# Altium schematic sheet BCM4.SchDoc
size A4; SheetNumber: 4; SheetTotal: 5
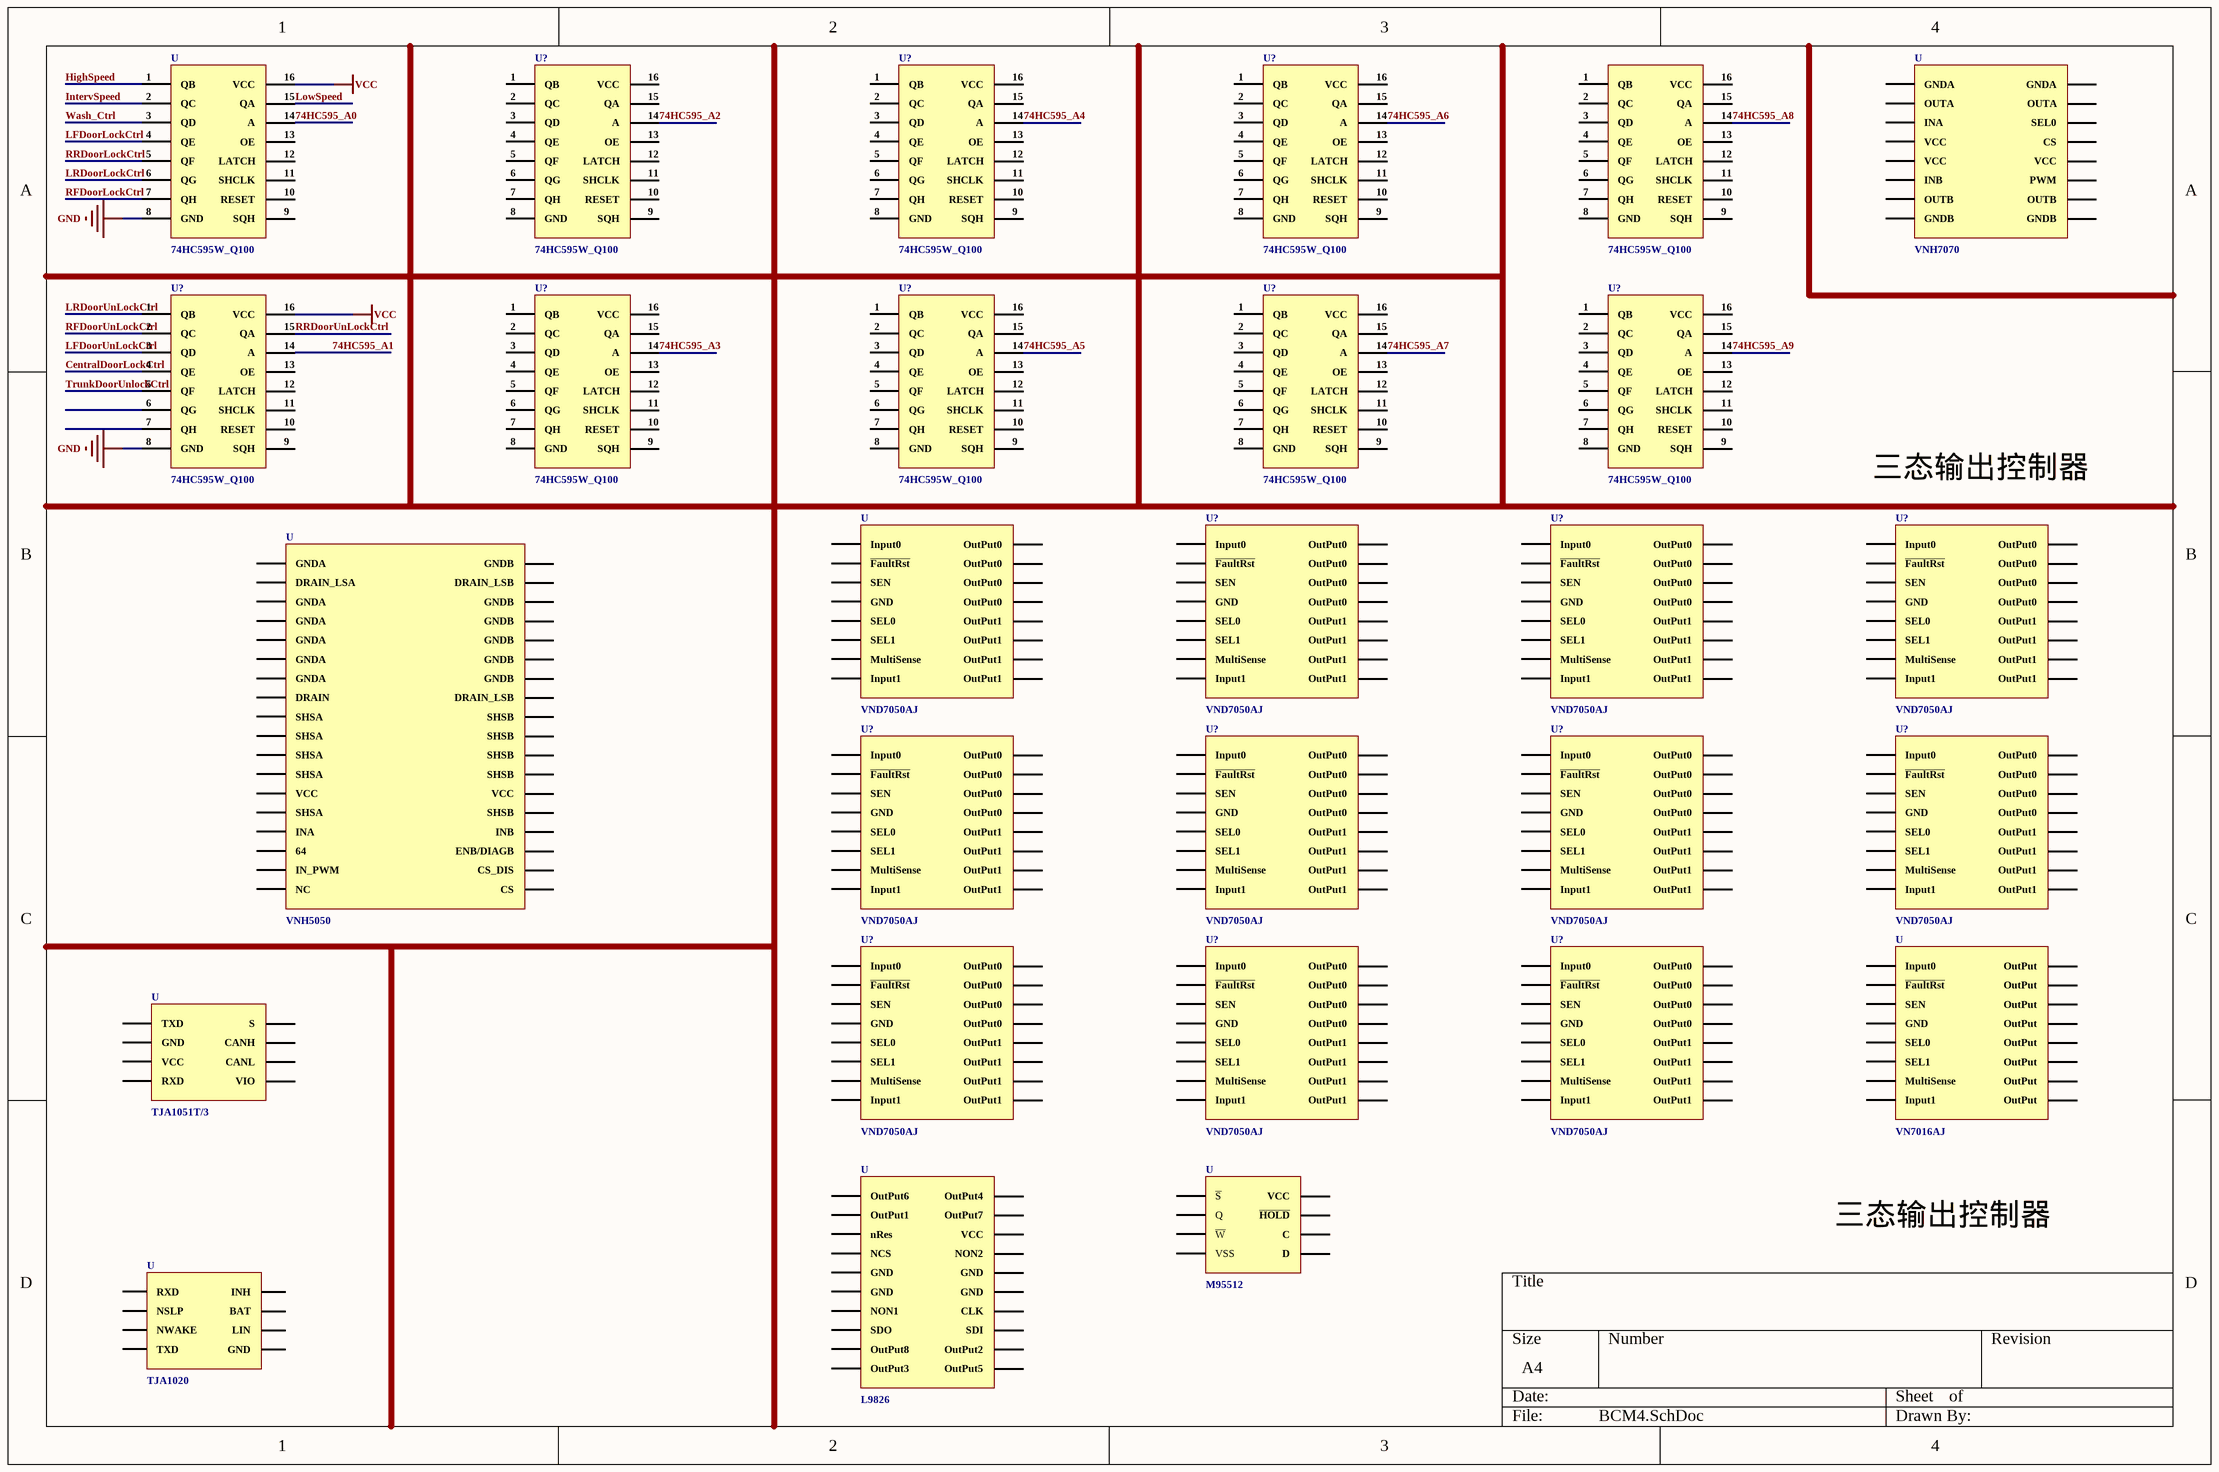
[diagram p0: BCM4.SchDoc]

## Parts
(Parts that share a designator on the sheet are numbered #1, #2 ... from top to bottom, then left to right.)
?  74HC595W_Q100
U#1  74HC595W_Q100
U#2  VNH7070
U#3  VND7050AJ
U#4  VNH5050
U#5  TJA1051T/3
U#6  VN7016AJ
U#7  M95512
U#8  TJA1020
U#9  L9826
U?#1  74HC595W_Q100
U?#2  74HC595W_Q100
U?#3  74HC595W_Q100
U?#4  74HC595W_Q100
U?#5  74HC595W_Q100
U?#6  74HC595W_Q100
U?#7  74HC595W_Q100
U?#8  74HC595W_Q100
U?#9  VND7050AJ
U?#10  VND7050AJ
U?#11  VND7050AJ
U?#12  VND7050AJ
U?#13  VND7050AJ
U?#14  VND7050AJ
U?#15  VND7050AJ
U?#16  VND7050AJ
U?#17  VND7050AJ
U?#18  VND7050AJ

## Nets
GND: U#1.8(GND) U?#4.8(GND)
VCC: U#1.16(VCC) U?#4.16(VCC)
74HC595_A0: U#1.14(A)
74HC595_A1: U?#4.14(A)
74HC595_A2: U?#1.14(A)
74HC595_A3: U?#5.14(A)
74HC595_A4: U?#2.14(A)
74HC595_A5: U?#6.14(A)
74HC595_A6: U?#3.14(A)
74HC595_A7: U?#7.14(A)
74HC595_A8: ?.14(A)
74HC595_A9: U?#8.14(A)
CentralDoorLockCtrl: U?#4.4(QE)
HighSpeed: U#1.1(QB)
IntervSpeed: U#1.2(QC)
LFDoorLockCtrl: U#1.4(QE)
LFDoorUnLockCtrl: U?#4.3(QD)
LowSpeed: U#1.15(QA)
LRDoorLockCtrl: U#1.6(QG)
LRDoorUnLockCtrl: U?#4.1(QB)
RFDoorLockCtrl: U#1.7(QH)
RFDoorUnLockCtrl: U?#4.2(QC)
RRDoorLockCtrl: U#1.5(QF)
RRDoorUnLockCtrl: U?#4.15(QA)
TrunkDoorUnlockCtrl: U?#4.5(QF)
Wash_Ctrl: U#1.3(QD)

Not connected (* = marked no-connect by the designer): ? 1(QB) 2(QC) 3(QD) 4(QE) 5(QF) 6(QG) 7(QH) 8(GND) 9(SQH) 10(RESET) 11(SHCLK) 12(LATCH) 13(OE) 15(QA) 16(VCC); U#1 9(SQH) 10(RESET) 11(SHCLK) 12(LATCH) 13(OE); U#2 67(GNDA) 68(INA) 69(OUTA) 70(VCC) 71(VCC) 72(INB) 73(OUTB) 74(GNDB) 75(GNDA) 76(OUTA) 77(SEL0) 78(CS) 79(VCC) 80(PWM) 81(OUTB) 82(GNDB); U#3 83(Input0) 84(~{FaultRst}) 85(SEN) 86(GND) 87(SEL0) 88(SEL1) 89(MultiSense) 90(Input1) 91(OutPut0) 92(OutPut0) 93(OutPut0) 94(OutPut0) 95(OutPut1) 96(OutPut1) 97(OutPut1) 98(OutPut1); U#4 58(GNDA) 59(DRAIN_LSA) 60(GNDA) 61(GNDA) 62(GNDA) 63(GNDA) 64(GNDA) 65(DRAIN) 66(SHSA); U#5 129(TXD) 130(GND) 131(VCC) 132(RXD) 133(S) 134(CANH) 135(CANL) 136(VIO); U#6 83(Input0) 84(~{FaultRst}) 85(SEN) 86(GND) 87(SEL0) 88(SEL1) 89(MultiSense) 90(Input1) 99(OutPut) 100(OutPut) 101(OutPut) 102(OutPut) 103(OutPut) 104(OutPut) 105(OutPut) 106(OutPut); U#7 117(~{S}) 118(Q) 119(~{W}) 120(VSS) 121(VCC) 122(~{HOLD}) 123(C) 124(D); U#8 125(RXD) 126(NSLP) 127(NWAKE) 128(TXD); U#9 107(OutPut6) 108(OutPut1) 109(nRes) 110(NCS) 111(GND) 112(GND) 113(NON1) 114(SDO) 115(OutPut8) 116(OutPut3); U?#1 1(QB) 2(QC) 3(QD) 4(QE) 5(QF) 6(QG) 7(QH) 8(GND) 9(SQH) 10(RESET) 11(SHCLK) 12(LATCH) 13(OE) 15(QA) 16(VCC); U?#2 1(QB) 2(QC) 3(QD) 4(QE) 5(QF) 6(QG) 7(QH) 8(GND) 9(SQH) 10(RESET) 11(SHCLK) 12(LATCH) 13(OE) 15(QA) 16(VCC); U?#3 1(QB) 2(QC) 3(QD) 4(QE) 5(QF) 6(QG) 7(QH) 8(GND) 9(SQH) 10(RESET) 11(SHCLK) 12(LATCH) 13(OE) 15(QA) 16(VCC); U?#4 6(QG) 7(QH) 9(SQH) 10(RESET) 11(SHCLK) 12(LATCH) 13(OE); U?#5 1(QB) 2(QC) 3(QD) 4(QE) 5(QF) 6(QG) 7(QH) 8(GND) 9(SQH) 10(RESET) 11(SHCLK) 12(LATCH) 13(OE) 15(QA) 16(VCC); U?#6 1(QB) 2(QC) 3(QD) 4(QE) 5(QF) 6(QG) 7(QH) 8(GND) 9(SQH) 10(RESET) 11(SHCLK) 12(LATCH) 13(OE) 15(QA) 16(VCC); U?#7 1(QB) 2(QC) 3(QD) 4(QE) 5(QF) 6(QG) 7(QH) 8(GND) 9(SQH) 10(RESET) 11(SHCLK) 12(LATCH) 13(OE) 15(QA) 16(VCC); U?#8 1(QB) 2(QC) 3(QD) 4(QE) 5(QF) 6(QG) 7(QH) 8(GND) 9(SQH) 10(RESET) 11(SHCLK) 12(LATCH) 13(OE) 15(QA) 16(VCC); U?#9 83(Input0) 84(~{FaultRst}) 85(SEN) 86(GND) 87(SEL0) 88(SEL1) 89(MultiSense) 90(Input1) 91(OutPut0) 92(OutPut0) 93(OutPut0) 94(OutPut0) 95(OutPut1) 96(OutPut1) 97(OutPut1) 98(OutPut1); U?#10 83(Input0) 84(~{FaultRst}) 85(SEN) 86(GND) 87(SEL0) 88(SEL1) 89(MultiSense) 90(Input1) 91(OutPut0) 92(OutPut0) 93(OutPut0) 94(OutPut0) 95(OutPut1) 96(OutPut1) 97(OutPut1) 98(OutPut1); U?#11 83(Input0) 84(~{FaultRst}) 85(SEN) 86(GND) 87(SEL0) 88(SEL1) 89(MultiSense) 90(Input1) 91(OutPut0) 92(OutPut0) 93(OutPut0) 94(OutPut0) 95(OutPut1) 96(OutPut1) 97(OutPut1) 98(OutPut1); U?#12 83(Input0) 84(~{FaultRst}) 85(SEN) 86(GND) 87(SEL0) 88(SEL1) 89(MultiSense) 90(Input1) 91(OutPut0) 92(OutPut0) 93(OutPut0) 94(OutPut0) 95(OutPut1) 96(OutPut1) 97(OutPut1) 98(OutPut1); U?#13 83(Input0) 84(~{FaultRst}) 85(SEN) 86(GND) 87(SEL0) 88(SEL1) 89(MultiSense) 90(Input1) 91(OutPut0) 92(OutPut0) 93(OutPut0) 94(OutPut0) 95(OutPut1) 96(OutPut1) 97(OutPut1) 98(OutPut1); U?#14 83(Input0) 84(~{FaultRst}) 85(SEN) 86(GND) 87(SEL0) 88(SEL1) 89(MultiSense) 90(Input1) 91(OutPut0) 92(OutPut0) 93(OutPut0) 94(OutPut0) 95(OutPut1) 96(OutPut1) 97(OutPut1) 98(OutPut1); U?#15 83(Input0) 84(~{FaultRst}) 85(SEN) 86(GND) 87(SEL0) 88(SEL1) 89(MultiSense) 90(Input1) 91(OutPut0) 92(OutPut0) 93(OutPut0) 94(OutPut0) 95(OutPut1) 96(OutPut1) 97(OutPut1) 98(OutPut1); U?#16 83(Input0) 84(~{FaultRst}) 85(SEN) 86(GND) 87(SEL0) 88(SEL1) 89(MultiSense) 90(Input1) 91(OutPut0) 92(OutPut0) 93(OutPut0) 94(OutPut0) 95(OutPut1) 96(OutPut1) 97(OutPut1) 98(OutPut1); U?#17 83(Input0) 84(~{FaultRst}) 85(SEN) 86(GND) 87(SEL0) 88(SEL1) 89(MultiSense) 90(Input1) 91(OutPut0) 92(OutPut0) 93(OutPut0) 94(OutPut0) 95(OutPut1) 96(OutPut1) 97(OutPut1) 98(OutPut1); U?#18 83(Input0) 84(~{FaultRst}) 85(SEN) 86(GND) 87(SEL0) 88(SEL1) 89(MultiSense) 90(Input1) 91(OutPut0) 92(OutPut0) 93(OutPut0) 94(OutPut0) 95(OutPut1) 96(OutPut1) 97(OutPut1) 98(OutPut1)

## Notes on the sheet
- (near U?#11) 三态输出控制器
- 三态输出控制器